# Altium schematic sheet Gf.SchDoc
size A4
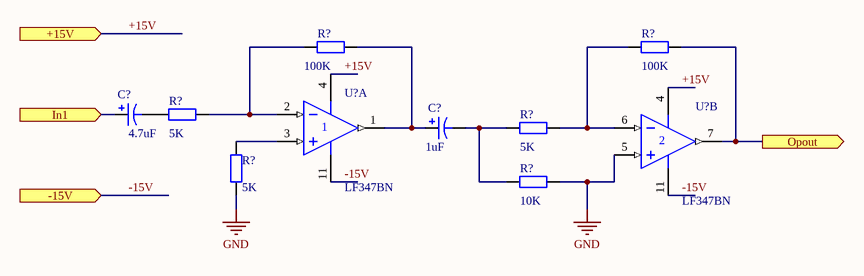
[diagram p0: Gf.SchDoc]

## Parts
(Parts that share a designator on the sheet are numbered #1, #2 ... from top to bottom, then left to right.)
C?#1  value 4.7uF  [RB7.6-15]  (hidden comment: Cap Pol1)
C?#2  value 1uF  [RB7.6-15]  (hidden comment: Cap Pol1)
R?#1  value 100K  [AXIAL-0.4]  (hidden comment: Res2)
R?#2  value 100K  [AXIAL-0.4]  (hidden comment: Res2)
R?#3  value 5K  [AXIAL-0.4]  (hidden comment: Res2)
R?#4  value 5K  [AXIAL-0.4]  (hidden comment: Res2)
R?#5  value 10K  [AXIAL-0.4]  (hidden comment: Res2)
R?#6  value 5K  [AXIAL-0.4]  (hidden comment: Res2)
U?#1  LF347BN  [N14A]  (part A of 4)
U?#2  LF347BN  [N14A]  (part B of 4)

## Ports
+15V (in), -15V (in), In1 (in), Opout (out)

## Nets
GND: R?#5.2 R?#6.1 U?#2.5(IN+)
+15V: U?#1.4(V+) U?#2.4(V+) ; port +15V
-15V: U?#1.11(V-) U?#2.11(V-) ; port -15V
In1: C?#1.1 ; port In1
Opout: R?#2.2 U?#2.7(OUT) ; port Opout
NetC?#1_2: C?#1.2 R?#4.2
NetC?#2_1: C?#2.1 R?#1.2 U?#1.1(OUT)
NetC?#2_2: C?#2.2 R?#3.1 R?#5.1
NetR?#1_1: R?#1.1 R?#4.1 U?#1.2(IN-)
NetR?#2_1: R?#2.1 R?#3.2 U?#2.6(IN-)
NetR?#6_2: R?#6.2 U?#1.3(IN+)

## Library data of the parts
C?#1 C?#2 = Cap Pol1: Polarized Capacitor (Radial); Published: 8-Jun-2000; LatestRevisionDate: 17-Jul-2002; LatestRevisionNote: Re-released for DXP Platform.; PackageReference: RB7.6-15; Publisher: Altium Limited
R?#1-R?#6 = Res2: Resistor; Published: 8-Jun-2000; LatestRevisionDate: 17-Jul-2002; LatestRevisionNote: Re-released for DXP Platform.; PackageReference: AXIAL-0.4; Publisher: Altium Limited
U?#1 U?#2 = LF347BN: Wide-Bandwidth Quad JFET Input Operational Amplifier; Published: 15-Apr-2002; LatestRevisionDate: 06-Jun-2005; LatestRevisionNote: Stylized 3D Model Added.; DatasheetVersion: May-1999; PackageVersion: 2000; PackageReference: N14A; Publisher: Altium Limited; PackageDescription: DIP; 14 Leads; Row Spacing 7.62 mm; Pitch 2.54 mm; ComponentLink1Description: Manufacturer Link; ComponentLink1URL: http://www.national.com/; ComponentLink2Description: Datasheet; ComponentLink2URL: http://www.national.com/ds.cgi/LF/LF147.pdf; ComponentLink3Description: URL Link1; ComponentLink3URL: http://www.national.com/pf/LF/LF347.html